# Altium schematic sheet PSU_VCC1V0_FPGA_Buck.SchDoc
size A3; SheetNumber: 5; SheetTotal: 32
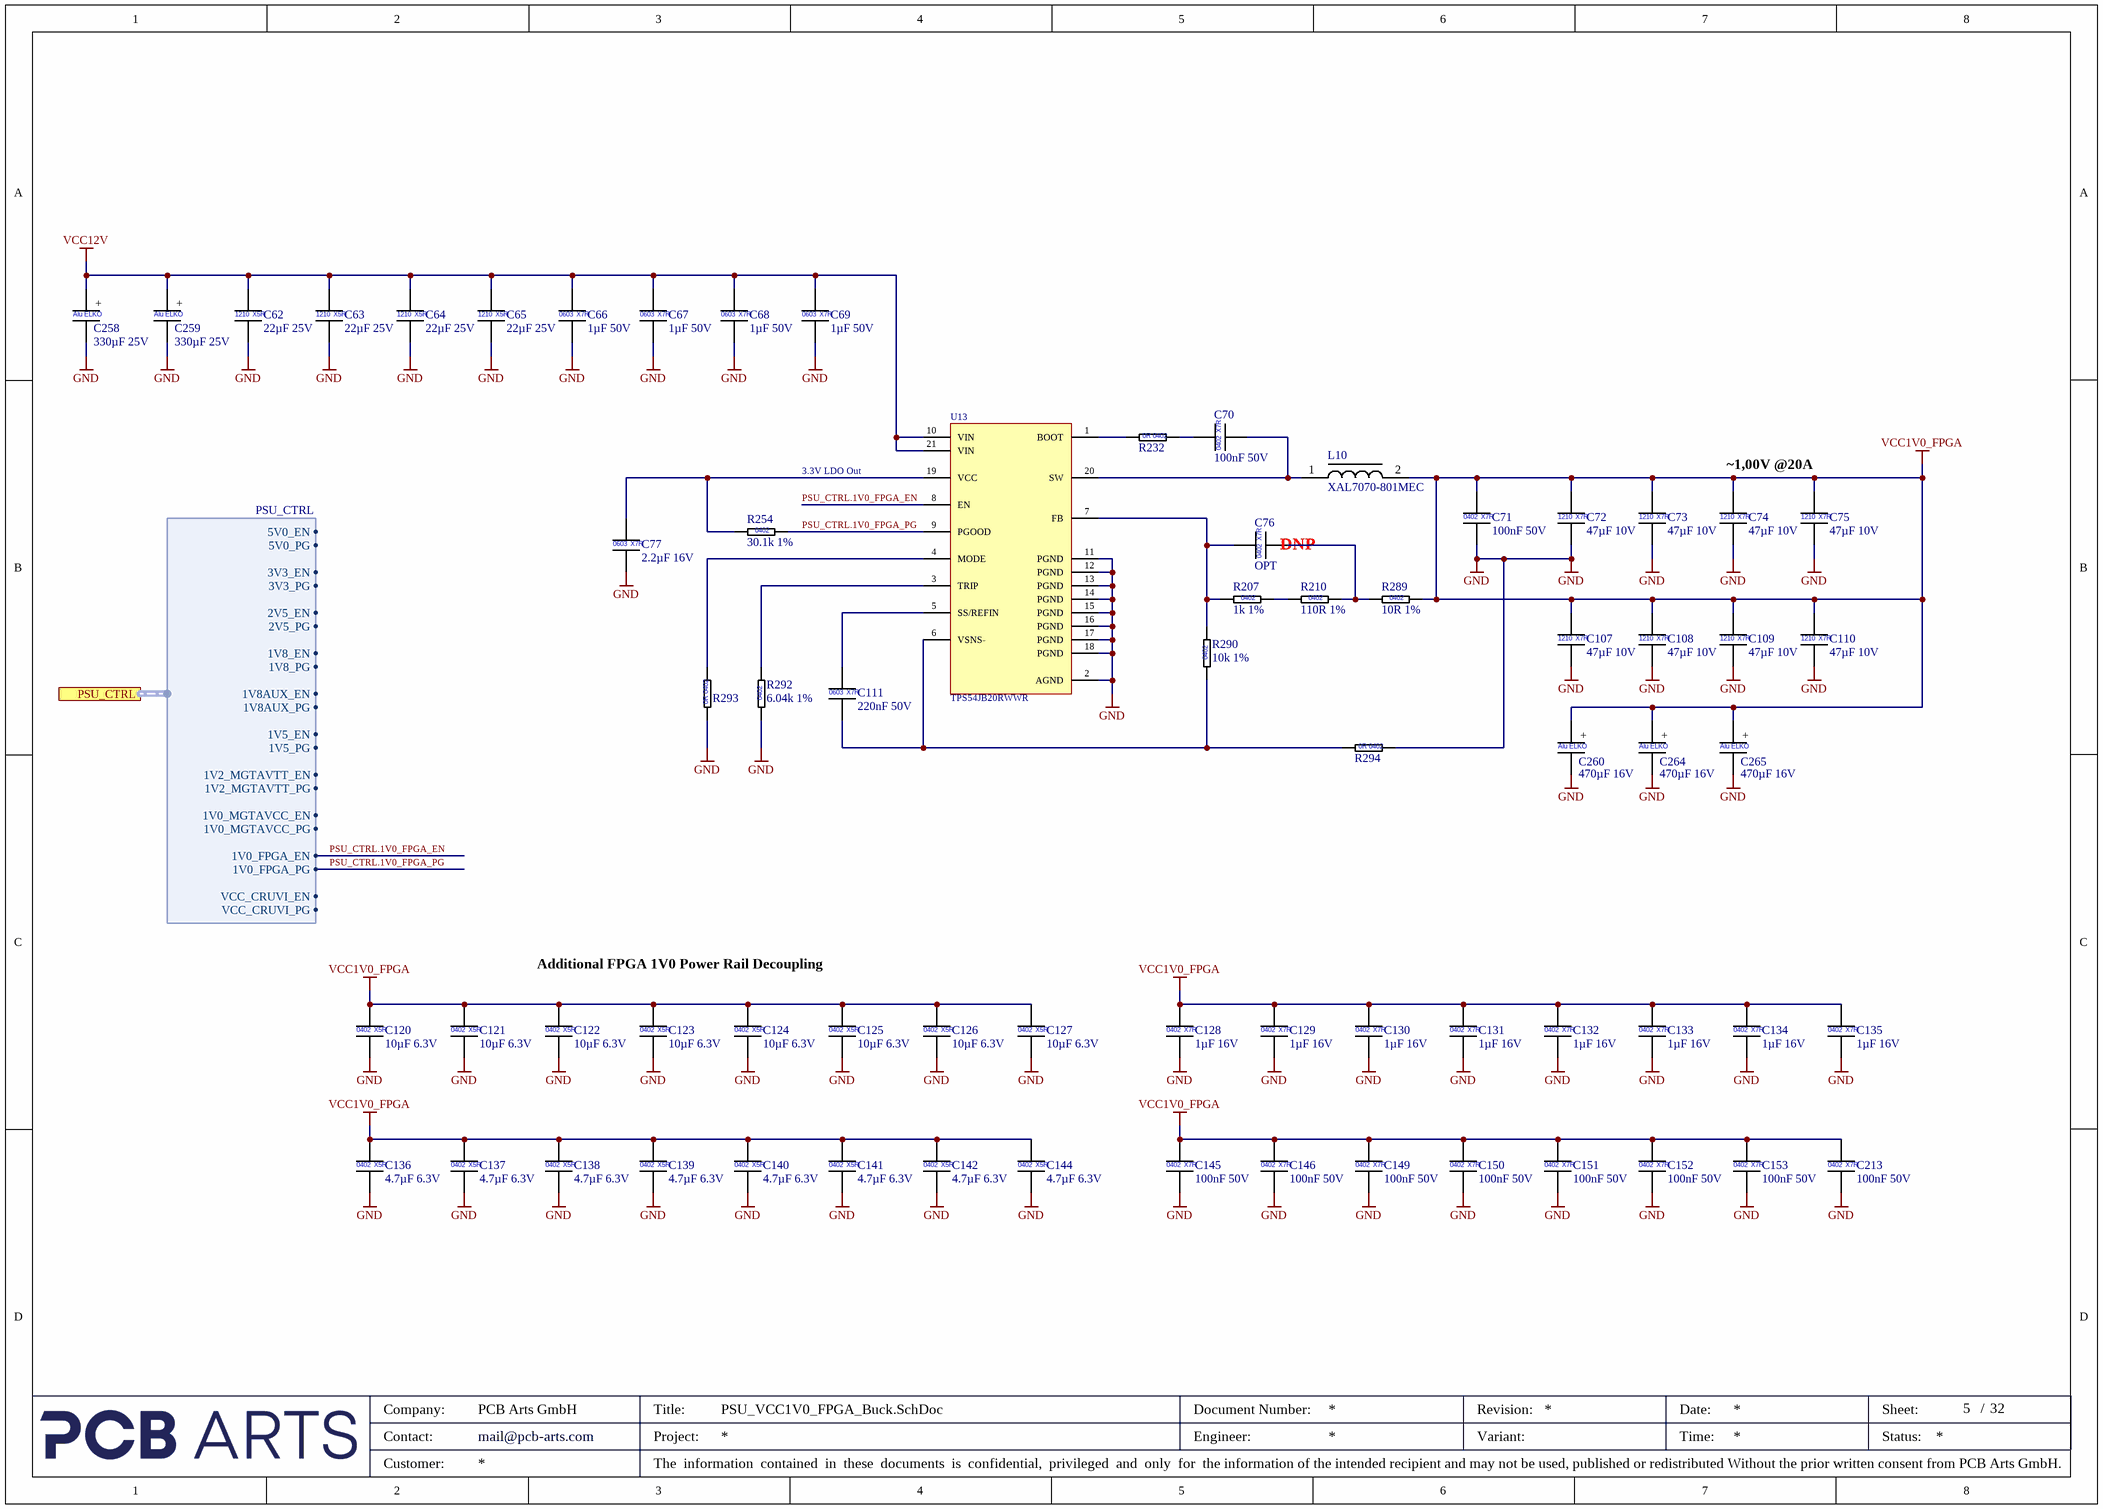
[diagram p0: PSU_VCC1V0_FPGA_Buck.SchDoc]

## Parts
C62  22µF 25V  [CAP_1210]
C63  22µF 25V  [CAP_1210]
C64  22µF 25V  [CAP_1210]
C65  22µF 25V  [CAP_1210]
C66  1µF 50V  [CAP_0603]
C67  1µF 50V  [CAP_0603]
C68  1µF 50V  [CAP_0603]
C69  1µF 50V  [CAP_0603]
C70  100nF 50V  [CAP_0402]
C71  100nF 50V  [CAP_0402]
C72  47µF 10V  [CAP_1210]
C73  47µF 10V  [CAP_1210]
C74  47µF 10V  [CAP_1210]
C75  47µF 10V  [CAP_1210]
C76  OPT  [CAP_0402]  (no BOM)
C77  2.2µF 16V  [CAP_0603]
C107  47µF 10V  [CAP_1210]
C108  47µF 10V  [CAP_1210]
C109  47µF 10V  [CAP_1210]
C110  47µF 10V  [CAP_1210]
C111  220nF 50V  [CAP_0603]
C120  10µF 6.3V  [CAP_0402_L]
C121  10µF 6.3V  [CAP_0402_L]
C122  10µF 6.3V  [CAP_0402_L]
C123  10µF 6.3V  [CAP_0402_L]
C124  10µF 6.3V  [CAP_0402_L]
C125  10µF 6.3V  [CAP_0402_L]
C126  10µF 6.3V  [CAP_0402_L]
C127  10µF 6.3V  [CAP_0402_L]
C128  1µF 16V  [CAP_0402_L]
C129  1µF 16V  [CAP_0402_L]
C130  1µF 16V  [CAP_0402_L]
C131  1µF 16V  [CAP_0402_L]
C132  1µF 16V  [CAP_0402_L]
C133  1µF 16V  [CAP_0402_L]
C134  1µF 16V  [CAP_0402_L]
C135  1µF 16V  [CAP_0402_L]
C136  4.7µF 6.3V  [CAP_0402_L]
C137  4.7µF 6.3V  [CAP_0402_L]
C138  4.7µF 6.3V  [CAP_0402_L]
C139  4.7µF 6.3V  [CAP_0402_L]
C140  4.7µF 6.3V  [CAP_0402_L]
C141  4.7µF 6.3V  [CAP_0402_L]
C142  4.7µF 6.3V  [CAP_0402_L]
C144  4.7µF 6.3V  [CAP_0402_L]
C145  100nF 50V  [CAP_0402_L]
C146  100nF 50V  [CAP_0402_L]
C149  100nF 50V  [CAP_0402_L]
C150  100nF 50V  [CAP_0402_L]
C151  100nF 50V  [CAP_0402_L]
C152  100nF 50V  [CAP_0402_L]
C153  100nF 50V  [CAP_0402_L]
C213  100nF 50V  [CAP_0402_L]
C258  330µF 25V  [WCAP-PTG5_D10H12.5]
C259  330µF 25V  [WCAP-PTG5_D10H12.5]
C260  470µF 16V  [WCAP-PTG5_D8H13]
C264  470µF 16V  [WCAP-PTG5_D8H13]
C265  470µF 16V  [WCAP-PTG5_D8H13]
L10  XAL7070-801MEC  [COILCRAFT_XAL7070]
R207  1k 1%  [RES_0402]
R210  110R 1%  [RES_0402]
R232  0R Jumper  [RES_0402]  (value not drawn)
R254  30.1k 1%  [RES_0402]
R289  10R 1%  [RES_0402]
R290  10k 1%  [RES_0402]
R292  6.04k 1%  [RES_0402]
R293  0R Jumper  [RES_0402]  (value not drawn)
R294  0R Jumper  [RES_0402]  (value not drawn)
U13  TPS54JB20RWWR  [VQFN-HR21_RWW0021A]

## Ports
PSU_CTRL (harness PSU_CTRL, see Power-Tree[2B], PSU_MGTAVCC_Buck[1B], PSU_MGTAVTT_Buck[1B], PSU_VCC1V5_Buck[1B], PSU_VCC1V8_Buck[1B], PSU_VCC1V8AUX_Buck[1B], PSU_VCC2V5_Buck[1B], PSU_VCC3V3_Buck[1B], PSU_VCC5V_Buck[1B], PSU_VCC_CRUVI_ADJ_Buck[1B])

## Harnesses
PSU_CTRL: 5V0_EN, 5V0_PG, 3V3_EN, 3V3_PG, 2V5_EN, 2V5_PG, 1V8_EN, 1V8_PG, 1V8AUX_EN, 1V8AUX_PG, 1V5_EN, 1V5_PG, 1V2_MGTAVTT_EN, 1V2_MGTAVTT_PG, 1V0_MGTAVCC_EN, 1V0_MGTAVCC_PG, 1V0_FPGA_EN, 1V0_FPGA_PG, VCC_CRUVI_EN, VCC_CRUVI_PG

## Nets
GND: C62.2 C63.2 C64.2 C65.2 C66.2 C67.2 C68.2 C69.2 C71.2 C72.2 C73.2 C74.2 C75.2 C77.2 C107.2 C108.2 C109.2 C110.2 C120.2 C121.2 C122.2 C123.2 C124.2 C125.2 C126.2 C127.2 C128.2 C129.2 C130.2 C131.2 C132.2 C133.2 C134.2 C135.2 C136.2 C137.2 C138.2 C139.2 C140.2 C141.2 C142.2 C144.2 C145.2 C146.2 C149.2 C150.2 C151.2 C152.2 C153.2 C213.2 C258.2 C259.2 C260.2 C264.2 C265.2 R292.1 R293.1 R294.2 U13.2(AGND) U13.11(PGND) U13.12(PGND) U13.13(PGND) U13.14(PGND) U13.15(PGND) U13.16(PGND) U13.17(PGND) U13.18(PGND)
VCC1V0_FPGA: C71.1 C72.1 C73.1 C74.1 C75.1 C107.1 C108.1 C109.1 C110.1 C120.1 C121.1 C122.1 C123.1 C124.1 C125.1 C126.1 C127.1 C128.1 C129.1 C130.1 C131.1 C132.1 C133.1 C134.1 C135.1 C136.1 C137.1 C138.1 C139.1 C140.1 C141.1 C142.1 C144.1 C145.1 C146.1 C149.1 C150.1 C151.1 C152.1 C153.1 C213.1 C260.1 C264.1 C265.1 L10.2 R289.2
VCC12V: C62.1 C63.1 C64.1 C65.1 C66.1 C67.1 C68.1 C69.1 C258.1 C259.1 U13.10(VIN) U13.21(VIN)
PSU_CTRL.1V0_FPGA_EN: U13.8(EN) ; port PSU_CTRL.1V0_FPGA_EN
PSU_CTRL.1V0_FPGA_PG: R254.2 U13.9(PGOOD) ; port PSU_CTRL.1V0_FPGA_PG
NetC70_1: C70.1 R232.2
NetC70_2: C70.2 L10.1 U13.20(SW)
NetC76_1: C76.1 R207.1 R290.2 U13.7(FB)
NetC76_2: C76.2 R210.2 R289.1
NetC77_1: C77.1 R254.1 U13.19(VCC)
NetC111_1: C111.1 U13.5(SS/REFIN)
NetC111_2: C111.2 R290.1 R294.1 U13.6(VSNS-)
NetR207_2: R207.2 R210.1
NetR232_1: R232.1 U13.1(BOOT)
NetR292_2: R292.2 U13.3(TRIP)
NetR293_2: R293.2 U13.4(MODE)

## Notes on the sheet
- 3.3V LDO Out
- (near C75) ~1,00V @20A
- (near C76) DNP
- Additional FPGA 1V0 Power Rail Decoupling
- Company:
- Contact:
- Customer:
- mail@pcb-arts.com
- PCB Arts GmbH
- Title:
- Project:
- The  information  contained  in  these  documents  is  confidential,  privileged  and  only  for  the information of the intended recipient and may not be used, published or redistributed Without the prior written consent from PCB Arts GmbH.
- Engineer:
- Document Number:
- Revision:
- Variant:
- Date:
- Time:
- Sheet:
- Status:
- /
- (in symbol CAP_0402_1µF_16V) 0402; X7R
- (in symbol CAP_0402_4.7µF_6.3V) 0402; X5R
- (in symbol CAP_0402_10µF_6.3V) 0402; X5R
- (in symbol CAP_0402_100nF_50V) X7R; 0402
- (in symbol CAP_0402_OPT) X7R; 0402
- (in symbol CAP_0603_1µF_50V_X7R_10%) 0603; X7R
- (in symbol CAP_0603_2.2µF_16V_X7R_10%) 0603; X7R
- (in symbol CAP_0603_220nF_50V_X7R_10%) 0603; X7R
- (in symbol CAP_1210_22µF_25V) 1210; X5R
- (in symbol CAP_1210_47µF_10V_X7R_10%) 1210; X7R
- (in symbol CAP_D8L9_470µF_16V) +; Alu ELKO
- (in symbol CAP_D10L12.5_330µF_25V) +; Alu ELKO
- (in symbol RES_0402_0R Jumper) 0R 0402
- (in symbol RES_0402_1k_1%) 0402
- (in symbol RES_0402_6.04k_1%) 0402
- (in symbol RES_0402_10k_1%) 0402
- (in symbol RES_0402_10R_1%) 0402
- (in symbol RES_0402_30.1k_1%) 0402
- (in symbol RES_0402_110R_1%) 0402

## Library data of the parts
C62-C65 = CAP_1210_22µF_25V: Multilayer Ceramic Capacitors MLCC - SMD/SMT 1210 25VDC; Manufacturer 1: KEMET; Manufacturer 1 Prt. Nr.: C1210C226K3PACTU; Manufacturer 2 Prt. Nr.: TMK212BBJ226MG-TT; Manufacturer 2: Taiyo Yuden
C66-C69 = CAP_0603_1µF_50V_X7R_10%: Multilayer Ceramic Capacitors MLCC - SMD/SMT 50V 1uF X7R 0603 10%; Manufacturer 1: KYOCERA AVX; Manufacturer 1 Prt. Nr.: 06035C105KAT2A; Manufacturer 2 Prt. Nr.: MSASU168AB7105KTNA01; Manufacturer 2: TAIYO YUDEN
C70 C71 C145 C146 C149-C153 C213 = CAP_0402_100nF_50V: Multilayer Ceramic Capacitors MLCC - SMD/SMT 0402 50VDC; Manufacturer 1: Murata Electronics; Manufacturer 1 Prt. Nr.: GCM155L8EH104KE07D; Manufacturer 2 Prt. Nr.: UMK105B7104KV-FR; Manufacturer 2: TDK
C72-C75 C107-C110 = CAP_1210_47µF_10V_X7R_10%: Multilayer Ceramic Capacitors MLCC - SMD/SMT 47 uF 10 VDC 10% 1210 X7R; Manufacturer 1: Murata Electronics; Manufacturer 1 Prt. Nr.: GRM32ER71A476KE15L; Manufacturer 2 Prt. Nr.: C1210C106K8RACTU; Manufacturer 2: KEMET
C76 = CAP_0402_OPT: Multilayer Ceramic Capacitors MLCC - SMD/SMT 0402 Optional Placeholder
C77 = CAP_0603_2.2µF_16V_X7R_10%: Multilayer Ceramic Capacitors MLCC - SMD/SMT 2.2 uF 16 VDC 10% 0603 X7R; Manufacturer 1: Murata Electronics; Manufacturer 1 Prt. Nr.: GRM188Z71C225KE43D; Manufacturer 2 Prt. Nr.: EMK107BB7225KA-T; Manufacturer 2: TAIYO YUDEN
C111 = CAP_0603_220nF_50V_X7R_10%: Multilayer Ceramic Capacitors MLCC - SMD/SMT 0.22 uF 50 VDC 10% 0603 X7R; Manufacturer 1: Murata Electronics; Manufacturer 1 Prt. Nr.: GRJ188R71H224KE11D; Manufacturer 2 Prt. Nr.: CGA3E3X7R1H224K080AE; Manufacturer 2: TDK
C120-C127 = CAP_0402_10µF_6.3V: Multilayer Ceramic Capacitors MLCC - SMD/SMT 0402 6.3VDC; Manufacturer 1: Murata Electronics; Manufacturer 1 Prt. Nr.: GRM155R60J106ME05J; Manufacturer 2 Prt. Nr.: CL05A106MQ5NRNC; Manufacturer 2: Samsung Electro-Mechanics
C128-C135 = CAP_0402_1µF_16V: Multilayer Ceramic Capacitors MLCC - SMD/SMT 0402 16VDC; Manufacturer 1: Taiyo Yuden; Manufacturer 1 Prt. Nr.: EMK105BJ105MVHF; Manufacturer 2 Prt. Nr.: GRM155R61E105KA12D; Manufacturer 2: Murata Electronics
C136-C142 C144 = CAP_0402_4.7µF_6.3V: Multilayer Ceramic Capacitors MLCC - SMD/SMT 0402 6.3VDC; Manufacturer 1: Murata Electronics; Manufacturer 1 Prt. Nr.: GRM155R60J475ME47J; Manufacturer 2 Prt. Nr.: CL05A475MQ5NRNC; Manufacturer 2: Samsung Electro-Mechanics
C258 C259 = CAP_D10L12.5_330µF_25V: Organische Polymer-Aluminiumkondensatoren 330uF 25 Volts 20% AEC-Q200; Manufacturer 1: Würth Elektronik; Manufacturer 1 Prt. Nr.: 870025575009
C260 C264 C265 = CAP_D8L9_470µF_16V: Organische Polymer-Aluminiumkondensatoren 470uF 16 Volts 20%; Manufacturer 1: Würth Elektronik; Manufacturer 1 Prt. Nr.: 870025374007
L10 = XAL7070-801MEC_Power Inductors SMD 800nH Shld 20% 25.8A 2.29mOhms AECQ200: Power Inductors - SMD 800nH Shld 20% 25.8A 2.29mOhms AECQ200; Manufacturer 1: Coilcraft; Manufacturer 1 Prt. Nr.: XAL7070-801MEC
R207 = RES_0402_1k_1%: Thick Film Resistors - SMD 1kOhm 1%; Manufacturer 1: Vishay / Dale; Manufacturer 1 Prt. Nr.: CRCW04021K00FKEDC; Manufacturer 2 Prt. Nr.: RC0402FR-7W1KL; Manufacturer 2: Yageo
R210 = RES_0402_110R_1%: Thick Film Resistors - SMD 110Ohm 1%; Manufacturer 1: Vishay / Dale; Manufacturer 1 Prt. Nr.: CRCW0402110RFKTD; Manufacturer 2 Prt. Nr.: RC0402FR-7W110RL; Manufacturer 2: Yageo
R232 R293 R294 = RES_0402_0R Jumper: Thick Film Resistors - SMD 0Ohm; Manufacturer 1: Vishay / Dale; Manufacturer 1 Prt. Nr.: CRCW04020000Z0EDC; Manufacturer 2 Prt. Nr.: RC0402JR-070RL; Manufacturer 2: Yageo
R254 = RES_0402_30.1k_1%: Thick Film Resistors - SMD 30.1kOhm 1%; Manufacturer 1: Vishay / Dale; Manufacturer 1 Prt. Nr.: CRCW040230K1FKEDC; Manufacturer 2 Prt. Nr.: RC0402FR-1330K1L; Manufacturer 2: Yageo
R289 = RES_0402_10R_1%: Thick Film Resistors - SMD 10Ohm 1%; Manufacturer 1: Vishay / Dale; Manufacturer 1 Prt. Nr.: CRCW040210R0FKEE; Manufacturer 2 Prt. Nr.: RC0402FR-7W10RL; Manufacturer 2: Yageo
R290 = RES_0402_10k_1%: Thick Film Resistors - SMD 10kOhm 1%; Manufacturer 1: Vishay / Dale; Manufacturer 1 Prt. Nr.: CRCW040210K0FKEDC; Manufacturer 2 Prt. Nr.: RC0402FR-7W10KL; Manufacturer 2: Yageo
R292 = RES_0402_6.04k_1%: Thick Film Resistors - SMD 6.04kOhm 1%; Manufacturer 1: Vishay / Dale; Manufacturer 1 Prt. Nr.: CRCW04026K04FKEDC; Manufacturer 2 Prt. Nr.: RC0402FR-7W6K04L; Manufacturer 2: Yageo
U13 = TPS54JB20RWWR_Switching Voltage Regulators 2.7-V to 16-V input 20-A synchronous Buck: Switching Voltage Regulators 2.7-V to 16-V input 20-A synchronous Buck; Manufacturer 1: Texas Instruments; Manufacturer 1 Prt. Nr.: TPS54JB20RWWR